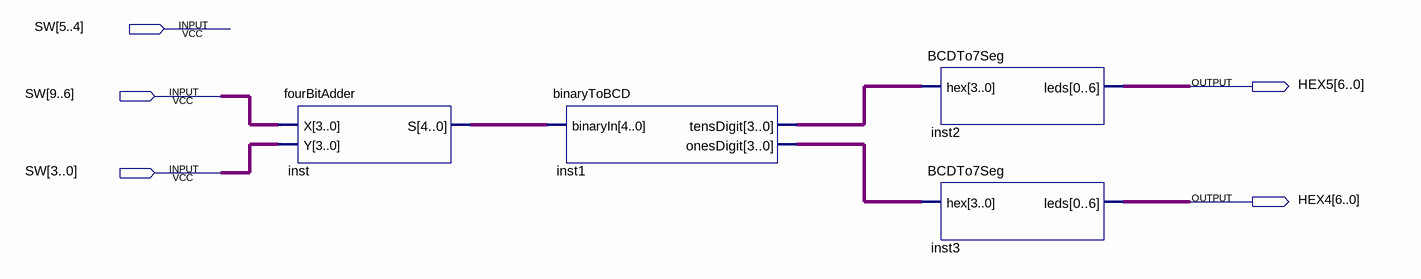
[diagram p0: schematic sheet]
// Quartus schematic lab1.bdf as structural Verilog: 4 symbols, 5 pins
module lab1 (
  input  [9:0] SW,
  output [6:0] HEX5,
  output [6:0] HEX4
);

  wire [3:0] inst1_onesdigit, inst1_tensdigit;
  wire [4:0] inst_s;

  fourBitAdder inst (.X(SW[9:6]), .Y(SW[3:0]), .S(inst_s));
  binaryToBCD inst1 (.binaryIn(inst_s), .tensDigit(inst1_tensdigit), .onesDigit(inst1_onesdigit));
  BCDTo7Seg inst2 (.hex(inst1_tensdigit), .leds(HEX5));
  BCDTo7Seg inst3 (.hex(inst1_onesdigit), .leds(HEX4));
endmodule
